# EasyEDA Pro project 8CH_ADC_CAPTURE_CARD.epro, schematic SMA
Create Date: 2025-01-18; Page Name: P1; Project Name: 8CH_ADC_CAPTURE_CARD; Schematic Name: Schematic1; Update Date: 2025-01-18; Company: 嘉立创EDA; Page Size: A4; Version: V1.0
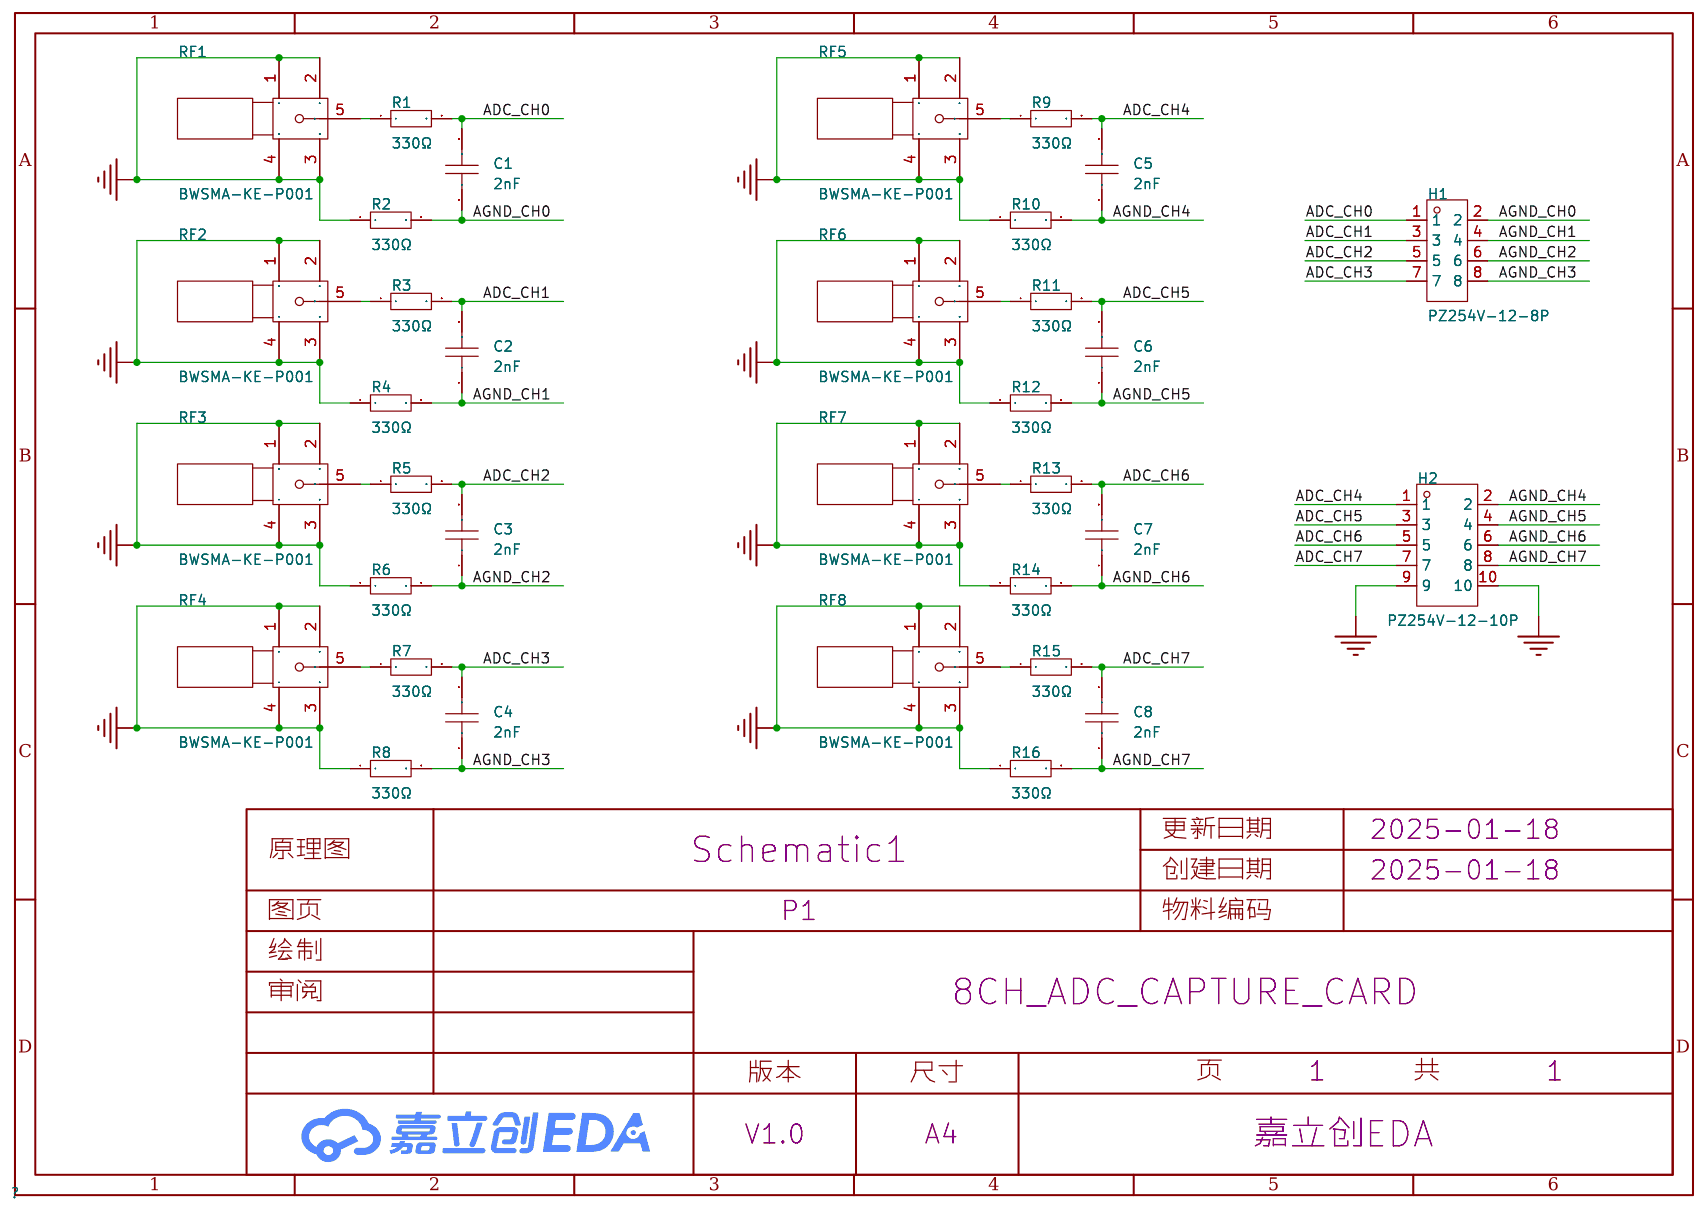
[diagram p9: schematic sheet]

## Parts
C1  2nF  [C0402]
C2  2nF  [C0402]
C3  2nF  [C0402]
C4  2nF  [C0402]
C5  2nF  [C0402]
C6  2nF  [C0402]
C7  2nF  [C0402]
C8  2nF  [C0402]
H1  PZ254V-12-8P  [HDR-TH_8P-P2.54-V-M-R2-C4-S2.54]
H2  PZ254V-12-10P  [HDR-TH_10P-P2.54-V-M-R2-C5-S2.54]
R1  330Ω  [R0402]
R2  330Ω  [R0402]
R3  330Ω  [R0402]
R4  330Ω  [R0402]
R5  330Ω  [R0402]
R6  330Ω  [R0402]
R7  330Ω  [R0402]
R8  330Ω  [R0402]
R9  330Ω  [R0402]
R10  330Ω  [R0402]
R11  330Ω  [R0402]
R12  330Ω  [R0402]
R13  330Ω  [R0402]
R14  330Ω  [R0402]
R15  330Ω  [R0402]
R16  330Ω  [R0402]
RF1  BWSMA-KE-P001  [SMA-SMD_BWSMA-KE-P001]
RF2  BWSMA-KE-P001  [SMA-SMD_BWSMA-KE-P001]
RF3  BWSMA-KE-P001  [SMA-SMD_BWSMA-KE-P001]
RF4  BWSMA-KE-P001  [SMA-SMD_BWSMA-KE-P001]
RF5  BWSMA-KE-P001  [SMA-SMD_BWSMA-KE-P001]
RF6  BWSMA-KE-P001  [SMA-SMD_BWSMA-KE-P001]
RF7  BWSMA-KE-P001  [SMA-SMD_BWSMA-KE-P001]
RF8  BWSMA-KE-P001  [SMA-SMD_BWSMA-KE-P001]

## Library data of the parts
C1-C8 = CC0402JRX7R9BB202: 容值:2nF;精度:±5%;额定电压:50V;材质(温度系数):X7R;; LCSC Part Name: 2nF ±5% 50V; Supplier Part: C541458; Manufacturer: YAGEO(国巨); Supplier Footprint: 0402; JLCPCB Part Class: 扩展库; Datasheet: https://atta.szlcsc.com/upload/public/pdf/source/20200615/C541458_18A599DF4DE33F2A6F988F71DADE7159.pdf; Supplier: LCSC; Tolerance: ±5%; Voltage Rated: 50V; Temperature Coefficient: X7R
H1 = PZ254V-12-8P: 插针结构:2x4P;间距:2.54mm;行距:2.54mm;圆针/方针:方针;安装类型:直插;排数:双排;总PIN位数:8P;额定电流:-;额定电压:-;配合针长度:6mm;塑高:2.5mm;端接针长度:3mm;触头材质:黄铜;触头镀层:-;工作温度范围:-40℃~+105℃;颜色:黑色;; LCSC Part Name: 间距:2.54mm 2x4P 直插 方针; Supplier Part: C492421; Manufacturer: XFCN(兴飞); Supplier Footprint: 插件,P=2.54mm; JLCPCB Part Class: 扩展库; Datasheet: https://atta.szlcsc.com/upload/public/pdf/source/20200309/C492421_DC8A206AF99CD7755BD4A5B0BC48200B.pdf; Supplier: LCSC; Pin Structure: 2x4P; Pitch: 2.54mm; Row Spacing: 2.54mm; Circluar Pins/Square Pins: 方针; Mounting Type: 直插; Number of Rows: 双排; Number of Pins: 8P; Length of Mating Pin: 6mm; Insulation Height: 2.5mm; Length of End Connection Pin: 3mm; Contact Material: 黄铜; Operating Temperature Range: -40℃~+105℃; Color: 黑色
H2 = PZ254V-12-10P: 插针结构:2x5P;间距:2.54mm;行距:2.54mm;圆针/方针:方针;安装类型:直插;排数:双排;总PIN位数:10P;额定电流:-;额定电压:-;配合针长度:6mm;塑高:2.5mm;端接针长度:3mm;触头材质:黄铜;触头镀层:-;工作温度范围:-40℃~+105℃;颜色:黑色;; LCSC Part Name: 间距:2.54mm 2x5P 直插 方针; Supplier Part: C492422; Manufacturer: XFCN(兴飞); Supplier Footprint: 插件,P=2.54mm; JLCPCB Part Class: 扩展库; Datasheet: https://atta.szlcsc.com/upload/public/pdf/source/20200309/C492422_5020CEA01BE7051F9EA9DD81AB0A25E3.pdf; Supplier: LCSC; Pin Structure: 2x5P; Pitch: 2.54mm; Row Spacing: 2.54mm; Circluar Pins/Square Pins: 方针; Mounting Type: 直插; Number of Rows: 双排; Number of Pins: 10P; Length of Mating Pin: 6mm; Insulation Height: 2.5mm; Length of End Connection Pin: 3mm; Contact Material: 黄铜; Operating Temperature Range: -40℃~+105℃; Color: 黑色
R1-R16 = 0402WGF3300TCE: 电阻类型:厚膜电阻;阻值:330Ω;精度:±1%;功率:62.5mW;最大工作电压:50V;温度系数:±100ppm/℃;; LCSC Part Name: 330Ω ±1% 62.5mW 厚膜电阻; Supplier Part: C25104; Manufacturer: UNI-ROYAL(厚声); Supplier Footprint: 0402; JLCPCB Part Class: 基础库; Datasheet: https://atta.szlcsc.com/upload/public/pdf/source/20200306/C422600_1E6D84923E4A46A82E41ADD87F860B5C.pdf; Supplier: LCSC; Type: 厚膜电阻; Tolerance: ±1%; Power(Watts): 62.5mW; Overload Voltage (Max): 50V; Temperature Coefficient: ±100ppm/℃; Operating Temperature Range: -55℃~+155℃
RF1-RF8 = BWSMA-KE-P001: 连接器类型:板端;接口类型:内孔;端口数量:1;接口直径:5.2mm;接口长度/高度:-;频率-最大值:-;射频系列:SMA;阻抗:50Ω;样式:偏脚;工作温度范围:-;; LCSC Part Name: 内孔 SMA 偏脚; Supplier Part: C496550; Manufacturer: BAT WIRELESS(蝙蝠无线); Supplier Footprint: SMD; JLCPCB Part Class: 扩展库; Datasheet: https://atta.szlcsc.com/upload/public/pdf/source/20240320/28FD502871C976DFF213ABFCF2A0ED51.pdf; Supplier: LCSC; Connector Type: 板端; Interface Type: 内孔; Number of Ports: 1; Interface Diameter: 5.2mm; RF Series: SMA; Impedance: 50Ω; Style: 偏脚

## Nets
AGND: H2.9 H2.10 R2.1 R4.1 R6.1 R8.1 R10.1 R12.1 R14.1 R16.1 RF1.1 RF1.2 RF1.3 RF1.4 RF2.1 RF2.2 RF2.3 RF2.4 RF3.1 RF3.2 RF3.3 RF3.4 RF4.1 RF4.2 RF4.3 RF4.4 RF5.1 RF5.2 RF5.3 RF5.4 RF6.1 RF6.2 RF6.3 RF6.4 RF7.1 RF7.2 RF7.3 RF7.4 RF8.1 RF8.2 RF8.3 RF8.4
AGND_CH0: C1.1 H1.2 R2.2
AGND_CH1: C2.1 H1.4 R4.2
AGND_CH2: C3.1 H1.6 R6.2
AGND_CH3: C4.1 H1.8 R8.2
AGND_CH4: C5.1 H2.2 R10.2
AGND_CH5: C6.1 H2.4 R12.2
AGND_CH6: C7.1 H2.6 R14.2
AGND_CH7: C8.1 H2.8 R16.2
ADC_CH0: C1.2 H1.1 R1.2
ADC_CH1: C2.2 H1.3 R3.2
ADC_CH2: C3.2 H1.5 R5.2
ADC_CH3: C4.2 H1.7 R7.2
ADC_CH4: C5.2 H2.1 R9.2
ADC_CH5: C6.2 H2.3 R11.2
ADC_CH6: C7.2 H2.5 R13.2
ADC_CH7: C8.2 H2.7 R15.2
$1N1025: R1.1 RF1.5
$1N1171: R3.1 RF2.5
$1N1296: R5.1 RF3.5
$1N1421: R7.1 RF4.5
$1N2146: R9.1 RF5.5
$1N2158: R11.1 RF6.5
$1N2170: R13.1 RF7.5
$1N2182: R15.1 RF8.5
